# EAGLE design power (EAGLE 5.07)
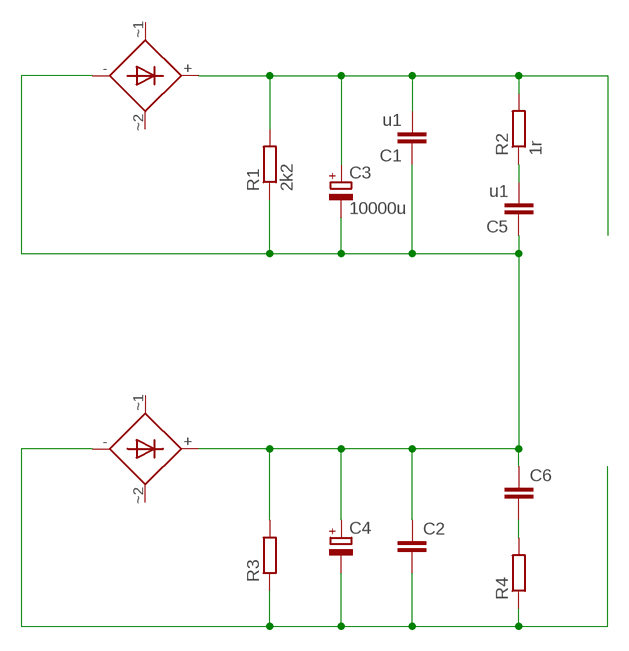
[diagram p0: schematic, sheet 1]

## Parts
B1  CP800REAL_OUTLINE  [CP800]
B2  CP800REAL_OUTLINE  [CP800]
C1  u1  C-EU050-025X075  [C050-025X075]
C2  C-EU050-025X075  [C050-025X075]
C3  10000u  CPOL-EUE10-35  [EB35D]
C4  CPOL-EUE10-35  [EB35D]
C5  u1  C-EU050-025X075  [C050-025X075]
C6  C-EU050-025X075  [C050-025X075]
R1  2k2  R-EU_0207/7  [0207/7]
R2  1r  R-EU_0207/7  [0207/7]
R3  R-EU_0207/7  [0207/7]
R4  R-EU_0207/7  [0207/7]

## Nets
N$4: B1.+ C1.2 C3.+ R1.2 R2.2
N$5: C5.2 R2.1
N$7: B1.- B2.+ C1.1 C2.1 C3.- C4.+ C5.1 C6.1 R1.1 R3.2
N$8: B2.- C2.2 C4.- R3.1 R4.1
N$9: C6.2 R4.2
Unconnected: B1.~1 B1.~2 B2.~1 B2.~2

## Library data of the parts
B1 B2 = mru-lib:CP800: CP800 Series Single Phase Bridge Rectifier multicomp Features: High surge current capability. PCB mounted/screw fixing. Surge overload rating: 200 Amperes peak. Low forward voltage drop and reverse leakage. Small size, simple installation. Reliable low cost construction utilizing moulded plastic technique. Mechanical Data: Mounting position : Any. Terminals : Leads solderable per MILSTD- 202, Method 208. Mounting : Through hole for a number 6 screw.
C1 C2 C5 C6 = resistor:C-EU: CAPACITOR, European symbol
C3 C4 = resistor:CPOL-EU: POLARIZED CAPACITOR, European symbol
R1-R4 = resistor:R-EU_: RESISTOR, European symbol

## Net classes
0 default: width 3.81 mm

## Board
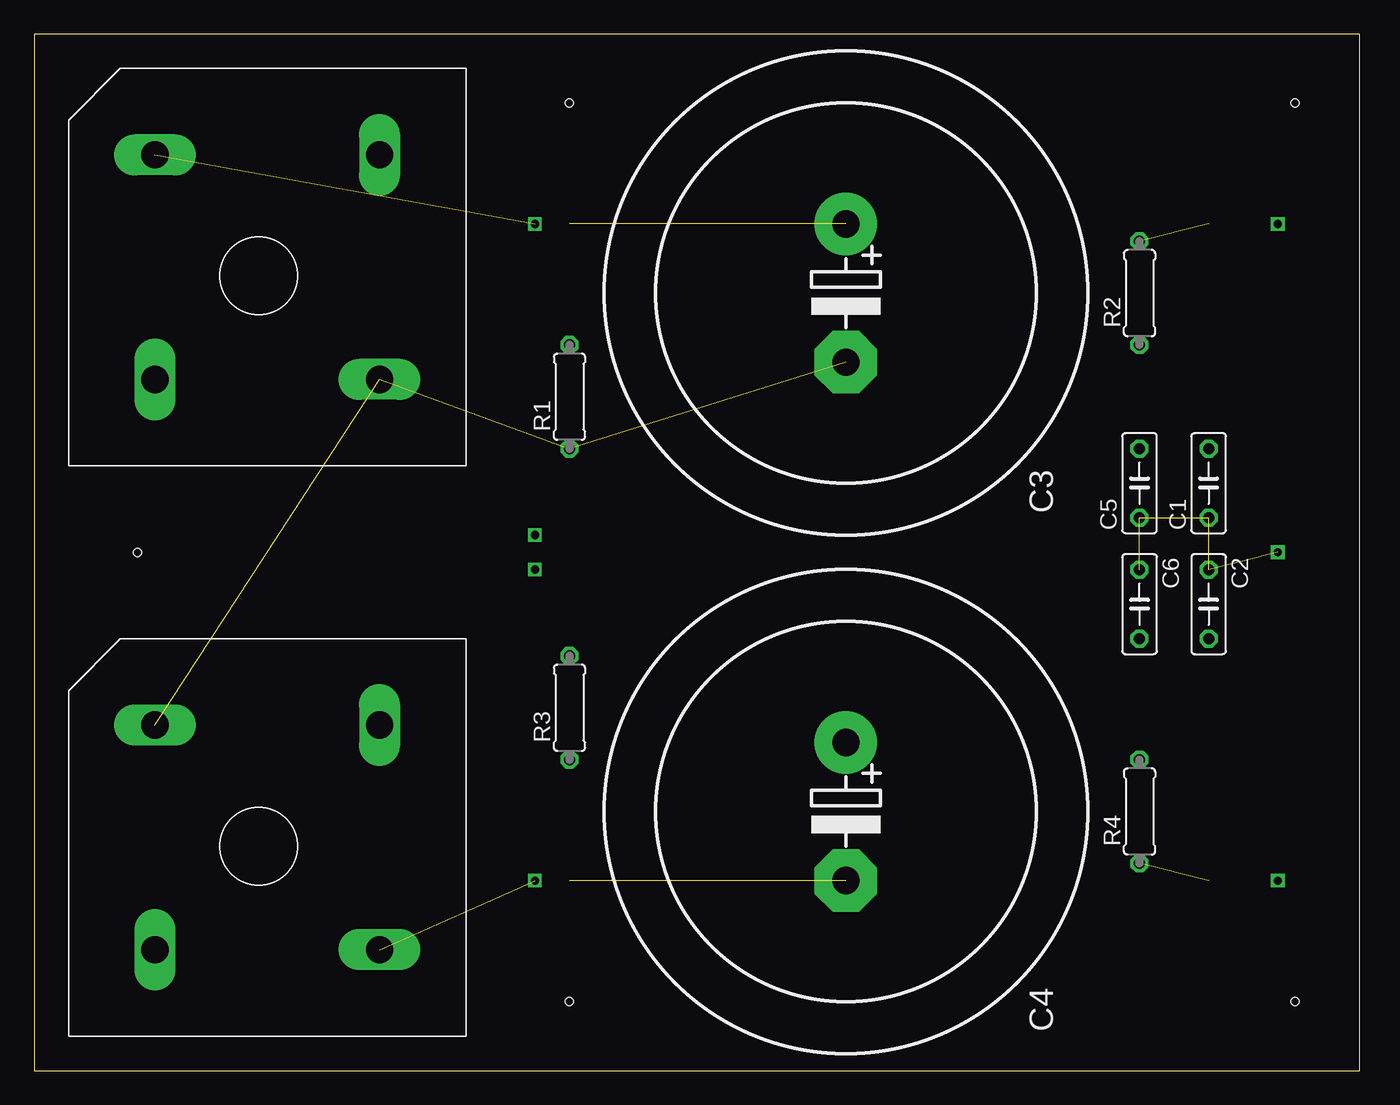
[diagram p1: board, top side]
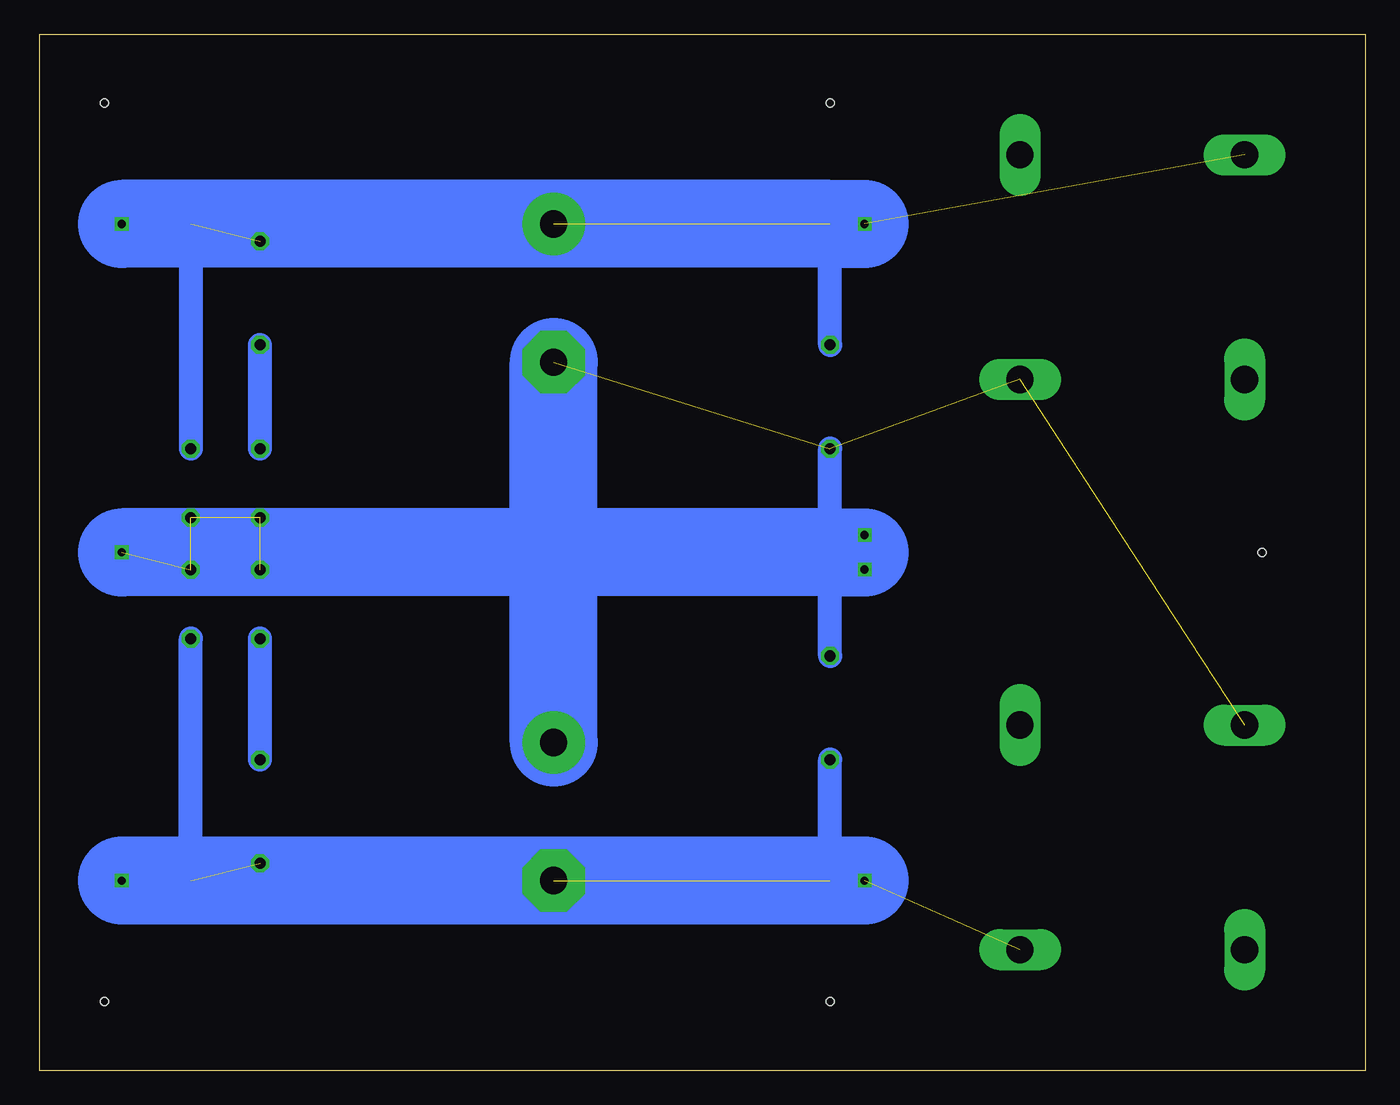
[diagram p2: board, bottom side, seen from below]

Size 97.46 x 76.19 mm. Coordinates in mm from the lower left corner, seen from the top.
Outline: 0,0 97.46,0 97.46,76.19 0,76.19 0,0
Copper layers (1*16): Top 0.035mm / dielectric 1.5mm / Bottom 0.035mm
Design rules "default": minimum track width 10mil, minimum drill 24mil, track to track 8mil, track to pad 8mil, pad to pad 8mil, via to via 8mil, smd to smd 8mil, copper to edge 40mil, drill to drill 8mil, minimum pad ring 10mil, minimum via ring 8mil, stop-mask expansion 4mil, vias tented up to drill 0mil, thermal gap 10mil
Holes 0.6 mm at 7.62,38.1 92.71,71.12 92.71,5.08 39.37,71.12 39.37,5.08

### Footprints (pad centres in the part's own frame; a part is rotated, then mirrored left to right if it is on the bottom)
CP800 = drill 2 long: + 7.62,-8.89; - -8.89,7.62; ~1 7.62,7.62; ~2 -8.89,-8.89
C050-025X075 = drill 0.813 octagon: 1 -2.54,0; 2 2.54,0
EB35D = drill 2.007 pad 4.597 round: + -5.08,0 | drill 2.007 pad 4.597 octagon: - 5.08,0
0207/7 = drill 0.813 octagon: 1 -3.81,0; 2 3.81,0

### Placement (x,y rotation side)
B1  16.51,58.42 180 top
B2  16.51,16.51 180 top
C1  86.36,43.18 90 top
C2  86.36,34.29 270 top
C3  59.69,57.15 270 top
C4  59.69,19.05 270 top
C5  81.28,43.18 90 top
C6  81.28,34.29 270 top
R1  39.37,49.53 90 top
R2  81.28,57.15 90 top
R3  39.37,26.67 90 top
R4  81.28,19.05 90 top

### Tracks (layer width: path | path; a pad name or v marks a point on that pad's centre or on a via)
N$1  (via drill 0.6)
  other vias: 36.83,39.37
N$2  (via drill 0.6)
  other vias: 36.83,36.83
N$4  (via drill 0.6)  (3 unrouted)
  Bottom 1.778: 86.36,62.23 C1.2 | R1.2 39.37,62.23
  Bottom 6.452: v36.83,62.23 39.37,62.23 86.36,62.23 v91.44,62.23
N$5
  Bottom 1.778: C5.2 R2.1
N$7  (via drill 0.6)  (7 unrouted)
  Bottom 1.778: R1.1 39.37,38.1 R3.2
  Bottom 6.452: 36.83,38.1 39.37,38.1 v91.44,38.1 | C4.+ C3.-
N$8  (via drill 0.6)  (3 unrouted)
  Bottom 1.778: 39.37,13.97 R3.1 | 86.36,13.97 C2.2
  Bottom 6.452: v36.83,13.97 39.37,13.97 86.36,13.97 v91.44,13.97
N$9
  Bottom 1.778: R4.2 C6.2